# EAGLE design freebus-drossel (EAGLE 4.16)
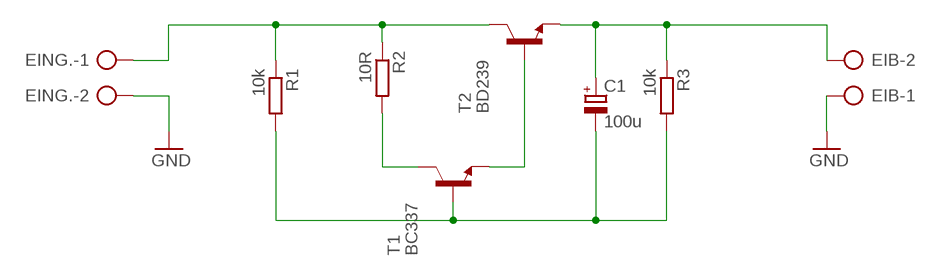
[diagram p0: schematic, sheet 1]

## Parts
C1  100u  CPOL-EUE5-13  [E5-13]
EIB  AK300/2  [AK300/2]
EING.  AK300/2  [AK300/2]
R1  10k  R-EU_0207/10  [0207/10]
R2  10R  R-EU_0207/10  [0207/10]
R3  10k  R-EU_0207/10  [0207/10]
T1  BC337  [TO92]
T2  BD239  [TO220]

## Nets
GND: EIB.1 EING..2
N$1: EING..1 R1.1 R2.1 T2.2(C)
N$2: C1.+ EIB.2 R3.1 T2.3(E)
N$3: C1.- R1.2 R3.2 T1.2(B)
N$4: T1.1(E) T2.1(B)
N$5: R2.2 T1.3(C)

## Library data of the parts
C1 = rcl:CPOL-EU: POLARIZED CAPACITOR, European symbol
EIB EING. = con-ptr500:AK300/2: CONNECTOR
R1-R3 = rcl:R-EU_: RESISTOR, European symbol
T1 = transistor:BC337: NPN TRANSISTOR
T2 = transistor:BD239: NPN TRANSISTOR Source: http://www.fairchildsemi.com/ds/BD/BD239C.pdf

## Net classes
0 default: width 0.508 mm

## Board
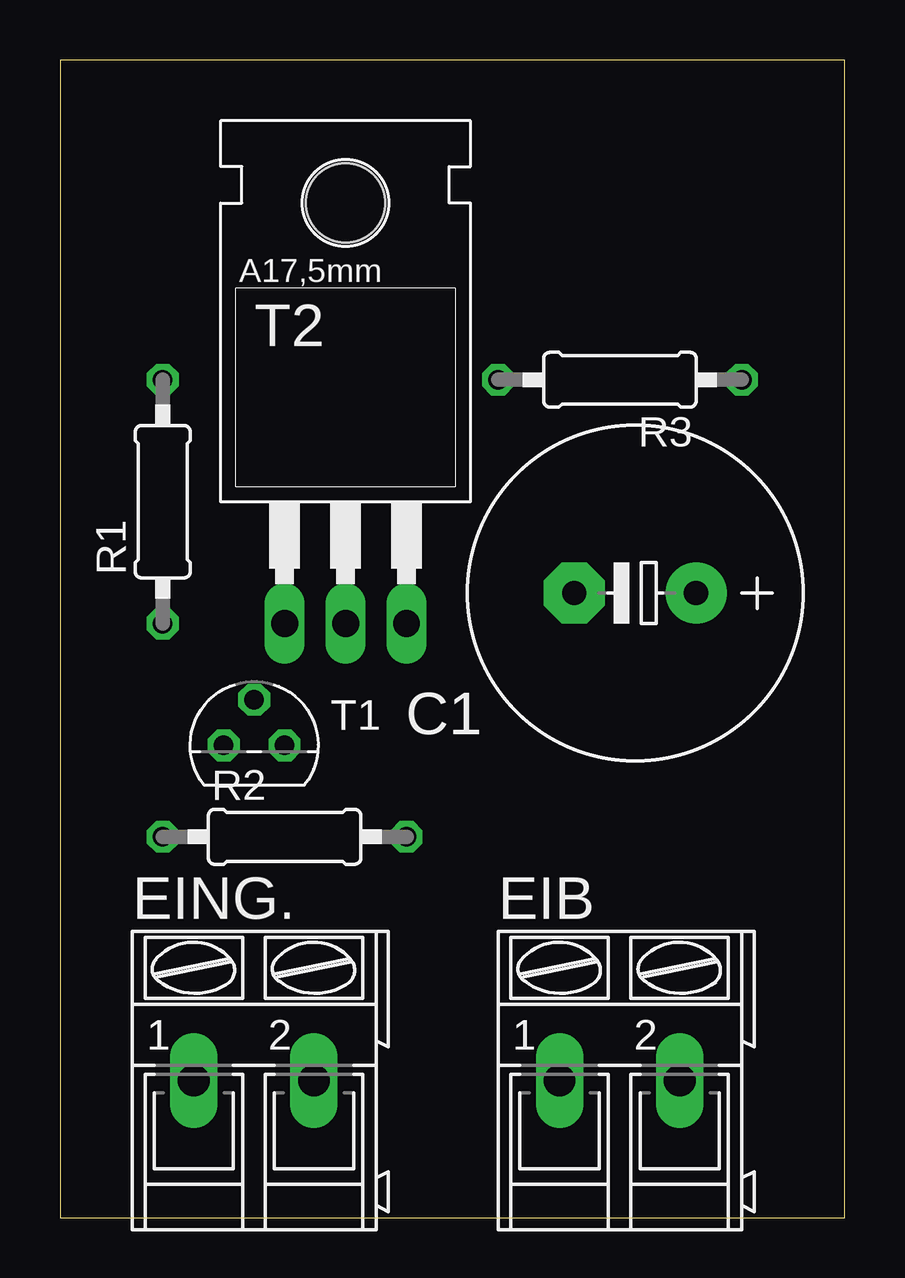
[diagram p1: board, top side]
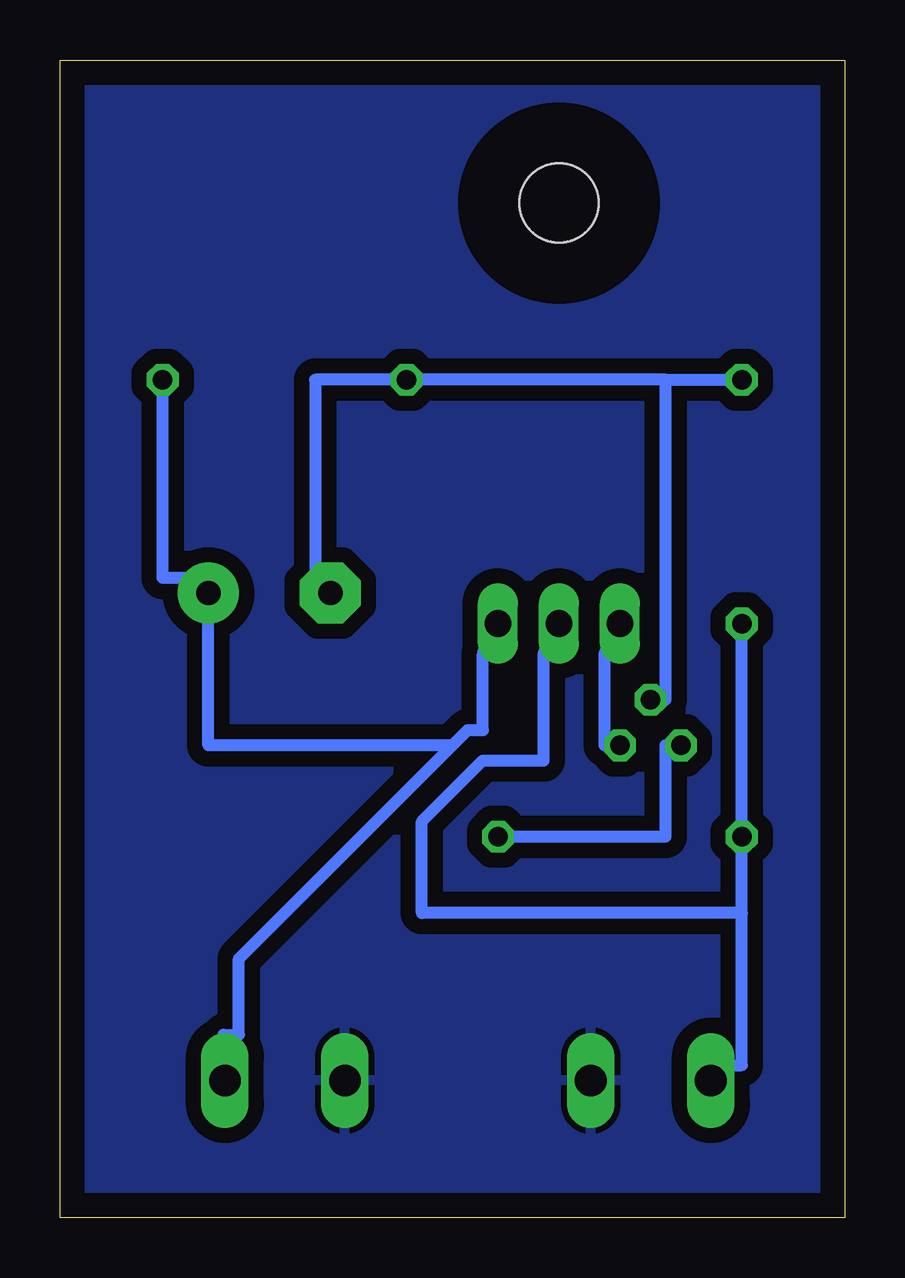
[diagram p2: board, bottom side, seen from below]

Size 32.69 x 48.25 mm. Coordinates in mm from the lower left corner, seen from the top.
Outline: 0,0 32.69,0 32.69,48.25 0,48.25 0,0
Copper layers (1*16): Top 0.035mm / dielectric 1.5mm / Bottom 0.035mm
Design rules "default": minimum track width 10mil, minimum drill 24mil, track to track 25mil, track to pad 25mil, pad to pad 8mil, via to via 8mil, smd to smd 8mil, copper to edge 40mil, drill to drill 8mil, minimum pad ring 10mil, minimum via ring 8mil, stop-mask expansion 4mil, vias tented up to drill 0mil, thermal gap 10mil

### Footprints (pad centres in the part's own frame; a part is rotated, then mirrored left to right if it is on the bottom)
E5-13 = drill 1.016 pad 2.54 round: + -2.54,0 | drill 1.016 pad 2.54 octagon: - 2.54,0
AK300/2 = drill 1.321 long: 1 -2.515,0; 2 2.489,0
0207/10 = drill 0.813 octagon: 1 -5.08,0; 2 5.08,0
TO92 = drill 0.813 octagon: 1 1.27,0; 2 0,1.905; 3 -1.27,0
TO220 = drill 1.118 long: 1 -2.54,-6.35; 2 0,-6.35; 3 2.54,-6.35 | hole 3.302: 0,11.176

### Placement (x,y rotation side)
C1  23.96,26.03 180 top
EIB  23.33,5.71 0 top
EING.  8.09,5.71 0 top
R1  4.28,29.84 90 top
R2  9.36,15.87 0 top
R3  23.33,34.92 180 top
T1  8.09,19.68 0 top
T2  11.9,31.11 0 top

### Tracks (layer width: path | path; a pad name or v marks a point on that pad's centre or on a via)
GND
  pour Bottom: 0.47,47.62 32.22,47.62 32.22,0.63 0.47,0.63
N$1
  Bottom 0.508: 4.28,12.7 4.28,6.34 4.92,6.34 EING..1 | 4.28,12.7 R2.1 R1.1 | 4.28,12.7 17.61,12.7 17.61,16.51 15.07,19.05 12.54,19.05 12.54,23.49 T2.2
N$2
  Bottom 0.508: 16.34,19.68 25.23,10.79 25.23,7.62 25.87,7.62 EIB.2 | 16.34,19.68 15.71,20.31 15.07,20.31 15.07,23.49 T2.3 | R3.1 28.41,26.66 27.14,26.66 C1.+ 26.5,19.68 16.34,19.68
N$3
  Bottom 0.508: 7.46,34.92 7.46,21.59 T1.2 | 7.46,34.92 R1.2 | 7.46,34.92 R3.2 22.06,34.92 22.06,26.66 C1.-
N$4
  Bottom 0.508: T1.1 9.99,19.68 9.99,23.49 T2.1
N$5
  Bottom 0.508: T1.3 7.46,19.68 7.46,15.87 R2.2